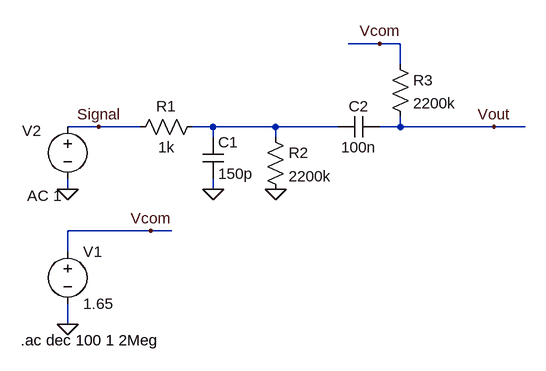
[diagram p0: schematic adc_frontend_first_stage.asc]
adc_frontend_first_stage.asc, the LTspice schematic file:
Version 4
SHEET 1 880 680
WIRE 464 16 416 16
WIRE 496 16 464 16
WIRE 496 48 496 16
WIRE 32 144 -16 144
WIRE 96 144 32 144
WIRE 208 144 176 144
WIRE 304 144 208 144
WIRE 400 144 304 144
WIRE 496 144 496 128
WIRE 496 144 464 144
WIRE 640 144 496 144
WIRE 688 144 640 144
WIRE 208 160 208 144
WIRE 304 160 304 144
WIRE -16 240 -16 224
WIRE 208 240 208 224
WIRE 112 304 -16 304
WIRE 144 304 112 304
WIRE -16 336 -16 304
WIRE -16 448 -16 416
FLAG 208 240 0
FLAG 304 240 0
FLAG -16 448 0
FLAG 112 304 Vcom
FLAG 464 16 Vcom
FLAG -16 240 0
FLAG 32 144 Signal
FLAG 640 144 Vout
SYMBOL res 192 128 R90
WINDOW 0 0 56 VBottom 2
WINDOW 3 32 56 VTop 2
SYMATTR InstName R1
SYMATTR Value 1k
SYMBOL cap 192 160 R0
SYMATTR InstName C1
SYMATTR Value 150p
SYMBOL res 288 144 R0
SYMATTR InstName R2
SYMATTR Value 2200k
SYMBOL cap 464 128 R90
WINDOW 0 0 32 VBottom 2
WINDOW 3 32 32 VTop 2
SYMATTR InstName C2
SYMATTR Value 100n
SYMBOL res 480 32 R0
SYMATTR InstName R3
SYMATTR Value 2200k
SYMBOL voltage -16 320 R0
WINDOW 123 0 0 Left 0
WINDOW 39 0 0 Left 0
SYMATTR InstName V1
SYMATTR Value 1.65
SYMBOL voltage -16 128 R0
WINDOW 0 -70 22 Left 2
WINDOW 3 -62 94 Left 2
WINDOW 123 -62 122 Left 2
WINDOW 39 0 0 Left 0
SYMATTR InstName V2
SYMATTR Value ""
SYMATTR Value2 AC 1
TEXT -88 472 Left 2 !.ac dec 100 1 2Meg

The netlist it stands for:
* adc_frontend_first_stage.asc
R1 N001 Signal 1k
C1 N001 0 150p
R2 N001 0 2200k
C2 Vout N001 100n
R3 Vcom Vout 2200k
V1 Vcom 0 1.65
V2 Signal 0 AC 1
.ac dec 100 1 2Meg
.backanno
.end